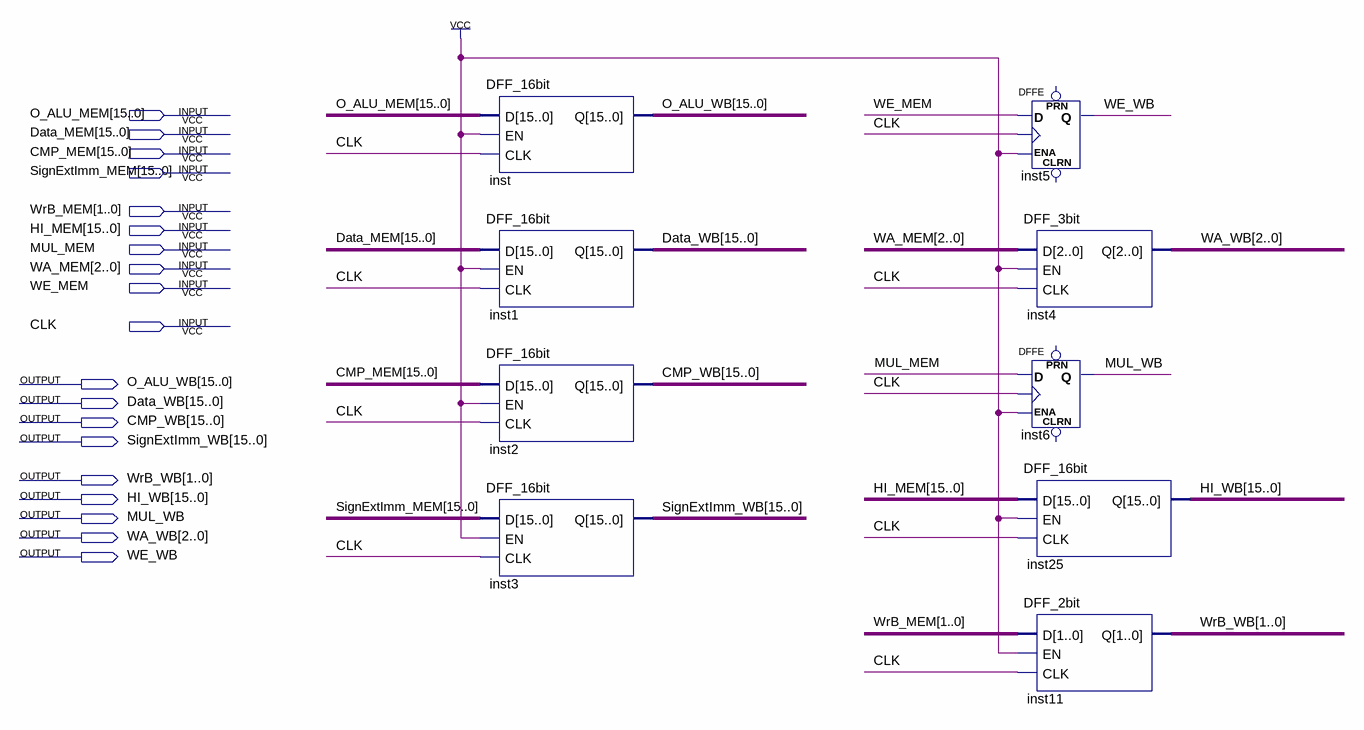
[diagram p0: schematic sheet]
// Quartus schematic MEM_WB.bdf as structural Verilog: 9 symbols, 19 pins
module MEM_WB (
  input  [15:0] O_ALU_MEM,
  input  [15:0] Data_MEM,
  input  [15:0] CMP_MEM,
  input  [15:0] SignExtImm_MEM,
  input  [1:0] WrB_MEM,
  input  [15:0] HI_MEM,
  input  MUL_MEM,
  input  [2:0] WA_MEM,
  input  WE_MEM,
  input  CLK,
  output [15:0] O_ALU_WB,
  output [15:0] Data_WB,
  output [15:0] CMP_WB,
  output [15:0] SignExtImm_WB,
  output [1:0] WrB_WB,
  output [15:0] HI_WB,
  output MUL_WB,
  output [2:0] WA_WB,
  output WE_WB
);

  DFF_16bit inst (.D(O_ALU_MEM), .EN(1'b1), .CLK(CLK), .Q(O_ALU_WB));
  DFF_16bit inst1 (.D(Data_MEM), .EN(1'b1), .CLK(CLK), .Q(Data_WB));
  DFF_16bit inst2 (.D(CMP_MEM), .EN(1'b1), .CLK(CLK), .Q(CMP_WB));
  DFF_16bit inst3 (.D(SignExtImm_MEM), .EN(1'b1), .CLK(CLK), .Q(SignExtImm_WB));
  DFFE inst5 (.D(WE_MEM), .CLK(CLK), .ENA(1'b1), .Q(WE_WB));  // open: PRN, CLRN
  DFF_3bit inst4 (.D(WA_MEM), .EN(1'b1), .CLK(CLK), .Q(WA_WB));
  DFFE inst6 (.D(MUL_MEM), .CLK(CLK), .ENA(1'b1), .Q(MUL_WB));  // open: PRN, CLRN
  DFF_16bit inst25 (.D(HI_MEM), .EN(1'b1), .CLK(CLK), .Q(HI_WB));
  DFF_2bit inst11 (.D(WrB_MEM), .EN(1'b1), .CLK(CLK), .Q(WrB_WB));
endmodule
